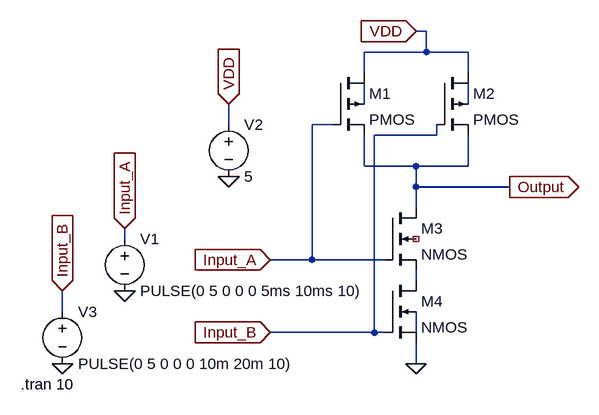
[diagram p0: schematic NAND_Using_CMOS.asc]
NAND_Using_CMOS.asc, the LTspice schematic file:
Version 4.1
SHEET 1 880 680
WIRE 224 0 208 0
WIRE 224 32 224 0
WIRE 224 32 128 32
WIRE 288 32 224 32
WIRE 128 64 128 32
WIRE 288 64 288 32
WIRE 128 112 128 80
WIRE 288 112 288 80
WIRE -80 144 -80 112
WIRE 80 144 48 144
WIRE 240 160 240 144
WIRE 240 160 144 160
WIRE 128 208 128 160
WIRE 208 208 128 208
WIRE 288 208 288 160
WIRE 288 208 208 208
WIRE 208 240 208 208
WIRE 352 240 208 240
WIRE 208 272 208 240
WIRE -240 320 -240 304
WIRE 48 352 48 144
WIRE 48 352 -16 352
WIRE 160 352 48 352
WIRE 208 384 208 368
WIRE -336 432 -336 400
WIRE 144 464 144 160
WIRE 144 464 -16 464
WIRE 160 464 144 464
WIRE 208 464 208 432
WIRE 208 512 208 480
FLAG 208 512 0
FLAG -16 352 Input_A
IOPIN -16 352 In
FLAG 208 0 VDD
IOPIN 208 0 In
FLAG 352 240 Output
IOPIN 352 240 Out
FLAG -80 224 0
FLAG -240 400 0
FLAG -16 464 Input_B
IOPIN -16 464 In
FLAG -80 112 VDD
IOPIN -80 112 In
FLAG -240 304 Input_A
IOPIN -240 304 In
FLAG -336 400 Input_B
IOPIN -336 400 In
FLAG -336 512 0
SYMBOL pmos4 80 64 R0
SYMATTR InstName M1
SYMBOL pmos4 240 64 R0
SYMATTR InstName M2
SYMBOL nmos4 160 272 R0
SYMATTR InstName M3
SYMBOL nmos4 160 384 R0
SYMATTR InstName M4
SYMBOL voltage -240 304 R0
WINDOW 123 0 0 Left 0
WINDOW 39 0 0 Left 0
SYMATTR InstName V1
SYMATTR Value PULSE(0 5 0 0 0 5ms 10ms 10)
SYMBOL voltage -80 128 R0
WINDOW 123 0 0 Left 0
WINDOW 39 0 0 Left 0
SYMATTR InstName V2
SYMATTR Value 5
SYMBOL voltage -336 416 R0
WINDOW 123 0 0 Left 0
WINDOW 39 0 0 Left 0
SYMATTR InstName V3
SYMATTR Value PULSE(0 5 0 0 0 10m 20m 10)
TEXT -400 544 Left 2 !.tran 10

The netlist it stands for:
* NAND_Using_CMOS.asc
M1 VDD Input_A Output N001 PMOS
M2 VDD Input_B Output N002 PMOS
M3 Output Input_A N003 NC_01 NMOS
M4 N003 Input_B 0 N004 NMOS
V1 Input_A 0 PULSE(0 5 0 0 0 5ms 10ms 10)
V2 VDD 0 5
V3 Input_B 0 PULSE(0 5 0 0 0 10m 20m 10)
.model NMOS NMOS
.model PMOS PMOS
.lib standard.mos
.tran 10
.backanno
.end